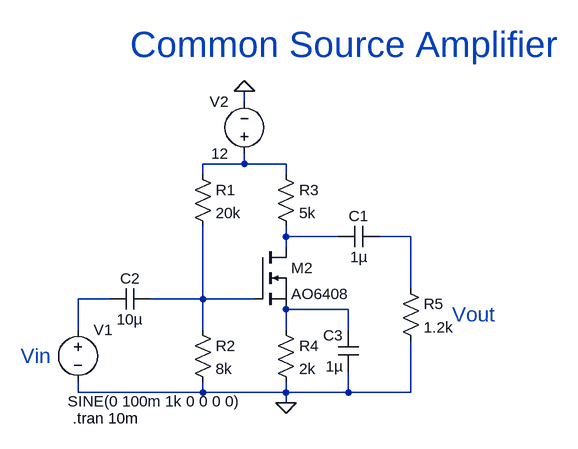
[diagram p0: schematic Common_Source_amp.asc]
Common_Source_amp.asc, the LTspice schematic file:
Version 4
SHEET 1 880 680
WIRE 192 -96 192 -112
WIRE 192 0 192 -16
WIRE 192 0 128 0
WIRE 256 0 192 0
WIRE 128 16 128 0
WIRE 256 16 256 0
WIRE 256 112 256 96
WIRE 336 112 256 112
WIRE 448 112 400 112
WIRE 256 128 256 112
WIRE 448 192 448 112
WIRE -16 208 -64 208
WIRE 128 208 128 96
WIRE 128 208 48 208
WIRE 208 208 128 208
WIRE 352 224 256 224
WIRE -64 256 -64 208
WIRE 128 256 128 208
WIRE 256 256 256 224
WIRE 352 256 352 224
WIRE -64 352 -64 336
WIRE 128 352 128 336
WIRE 128 352 -64 352
WIRE 256 352 256 336
WIRE 256 352 128 352
WIRE 352 352 352 320
WIRE 352 352 256 352
WIRE 448 352 448 272
WIRE 448 352 352 352
WIRE 256 368 256 352
FLAG 256 368 0
FLAG 192 -112 0
SYMBOL res 112 0 R0
SYMATTR InstName R1
SYMATTR Value 20k
SYMBOL res 112 240 R0
SYMATTR InstName R2
SYMATTR Value 8k
SYMBOL res 240 0 R0
SYMATTR InstName R3
SYMATTR Value 5k
SYMBOL cap 48 192 R90
WINDOW 0 0 32 VBottom 2
WINDOW 3 32 32 VTop 2
SYMATTR InstName C2
SYMATTR Value 10µ
SYMBOL voltage -64 240 R0
WINDOW 3 -16 126 Left 2
WINDOW 123 0 0 Left 0
WINDOW 39 0 0 Left 0
SYMATTR Value SINE(0 100m 1k 0 0 0 0)
SYMATTR InstName V1
SYMBOL voltage 192 0 R180
WINDOW 0 24 96 Left 2
WINDOW 3 24 16 Left 2
WINDOW 123 0 0 Left 0
WINDOW 39 0 0 Left 0
SYMATTR InstName V2
SYMATTR Value 12
SYMBOL cap 400 96 R90
WINDOW 0 0 32 VBottom 2
WINDOW 3 32 32 VTop 2
SYMATTR InstName C1
SYMATTR Value 1µ
SYMBOL cap 368 320 R180
WINDOW 0 24 56 Left 2
WINDOW 3 24 8 Left 2
SYMATTR InstName C3
SYMATTR Value 1µ
SYMBOL res 240 240 R0
SYMATTR InstName R4
SYMATTR Value 2k
SYMBOL res 432 176 R0
SYMATTR InstName R5
SYMATTR Value 1.2k
SYMBOL nmos 208 128 R0
SYMATTR InstName M2
SYMATTR Value AO6408
TEXT -72 392 Left 2 !.tran 10m
TEXT 16 -184 Left 5 ;Common Source Amplifier
TEXT 512 232 Left 3 ;Vout
TEXT -152 296 Left 3 ;Vin

The netlist it stands for:
* Common_Source_amp.asc
R1 N001 N005 20k
R2 N005 0 8k
R3 N001 N002 5k
C2 N005 N004 10µ
V1 N004 0 SINE(0 100m 1k 0 0 0 0)
V2 N001 0 12
C1 N003 N002 1µ
C3 0 N006 1µ
R4 N006 0 2k
R5 N003 0 1.2k
M2 N002 N005 N006 N006 AO6408
.model NMOS NMOS
.model PMOS PMOS
.lib standard.mos
.tran 10m
* Common Source Amplifier
* Vout
* Vin
.backanno
.end